# Altium schematic sheet oscillation.SchDoc
size A4
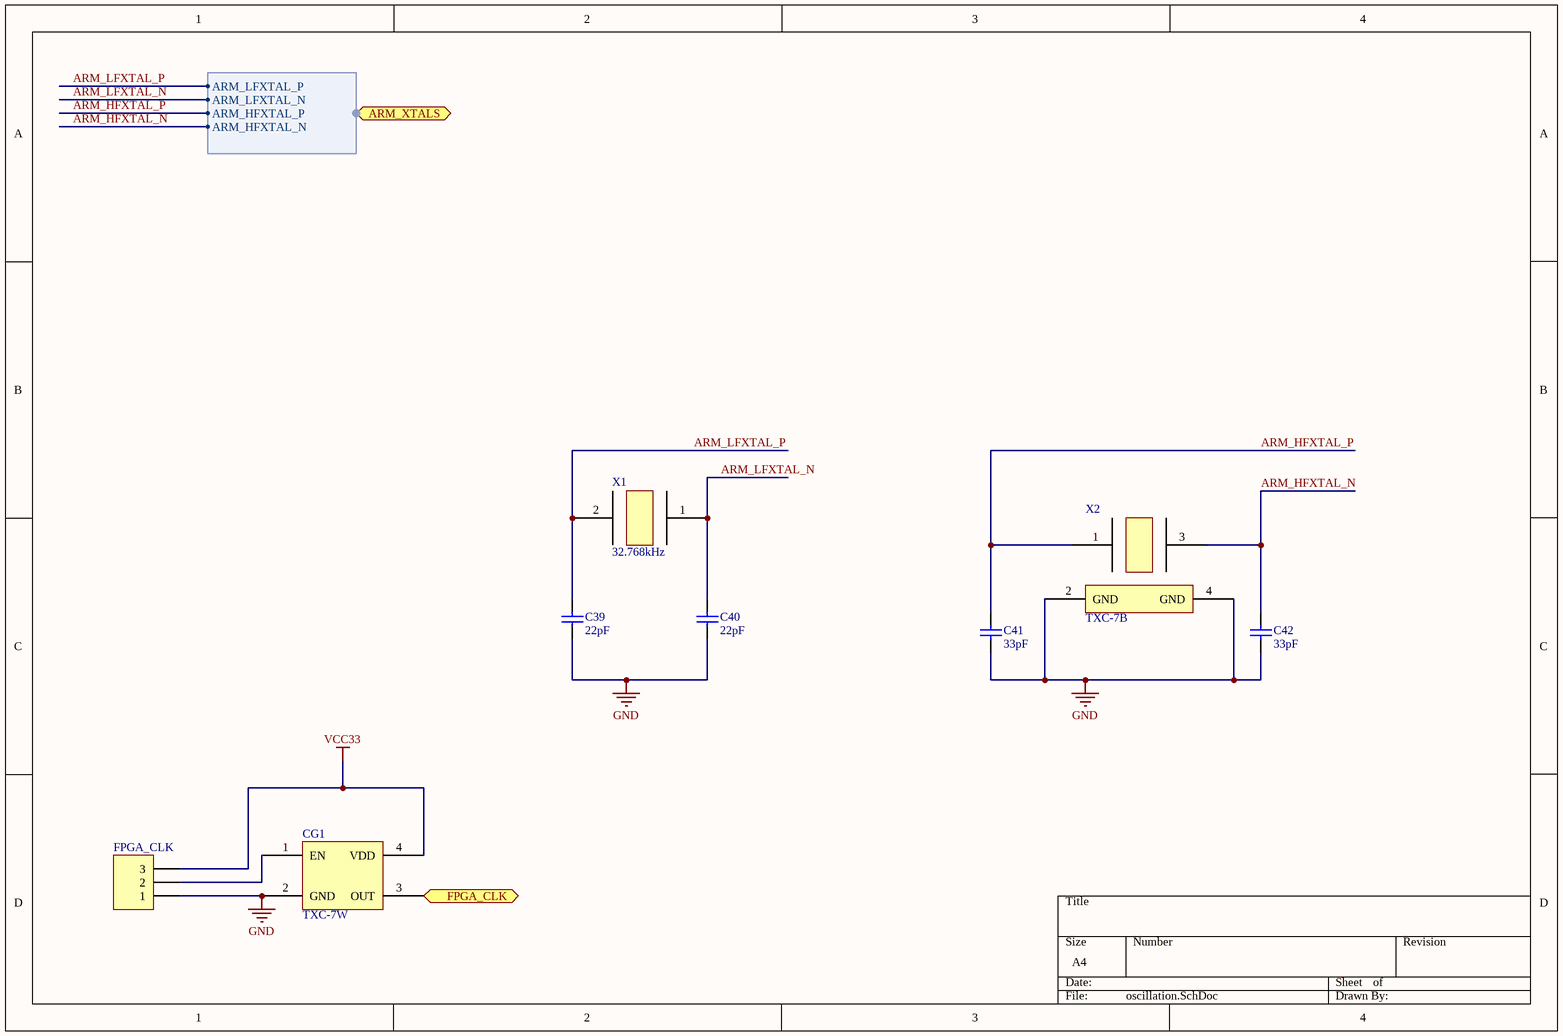
[diagram p0: oscillation.SchDoc]

## Parts
C39  22pF  [CAPC0805(2012)75_L]
C40  22pF  [CAPC0805(2012)75_L]
C41  33pF  [CAPC0805(2012)75_L]
C42  33pF  [CAPC0805(2012)75_L]
CG1  TXC-7W  [TXC-7W]
FPGA_CLK  Header 3  [HDR1X3]  (value not drawn)
X1  32.768kHz  [MC-306]
X2  TXC-7B  [TXC-7B]

## Ports
ARM_XTALS (harness ARM_XTALS), FPGA_CLK (out)

## Harnesses
ARM_XTALS: ARM_LFXTAL_P, ARM_LFXTAL_N, ARM_HFXTAL_P, ARM_HFXTAL_N

## Nets
GND: C39.1 C40.1 C41.2 C42.2 CG1.2(GND) FPGA_CLK.1 X2.2(GND) X2.4(GND)
VCC33: CG1.4(VDD) FPGA_CLK.3
ARM_HFXTAL_N: C42.1 X2.3 ; port ARM_XTALS.ARM_HFXTAL_N
ARM_HFXTAL_P: C41.1 X2.1 ; port ARM_XTALS.ARM_HFXTAL_P
ARM_LFXTAL_N: C40.2 X1.1 ; port ARM_XTALS.ARM_LFXTAL_N
ARM_LFXTAL_P: C39.2 X1.2 ; port ARM_XTALS.ARM_LFXTAL_P
FPGA_CLK: CG1.3(OUT) ; port FPGA_CLK
NetCG1_1: CG1.1(EN) FPGA_CLK.2

## Library data of the parts
C39 C40 = CMP-1036-01219-1: CAP 22pF 16V ±5% 0805 (2012 Metric) Thickness 0.75mm SMD; Case-Metric: 2012; Case-EIA: 0805; Technology: SMT; Max Thickness: 0.75 mm; Value: 22pF; Tolerance: ±5%; Rated Voltage: 16 V
C41 C42 = CMP-1036-01407-1: CAP 33pF 16V ±5% 0805 (2012 Metric) Thickness 0.75mm SMD; Case-Metric: 2012; Case-EIA: 0805; Value: 33pF; Max Thickness: 0.75 mm; Technology: SMT; Tolerance: ±5%; Rated Voltage: 16 V
FPGA_CLK = Header 3: Header, 3-Pin; LatestRevisionDate: 17-Jul-2002; LatestRevisionNote: Re-released for DXP Platform.; Publisher: Altium Limited
X1 = MC-306